# Altium schematic sheet main.SchDoc
size A4
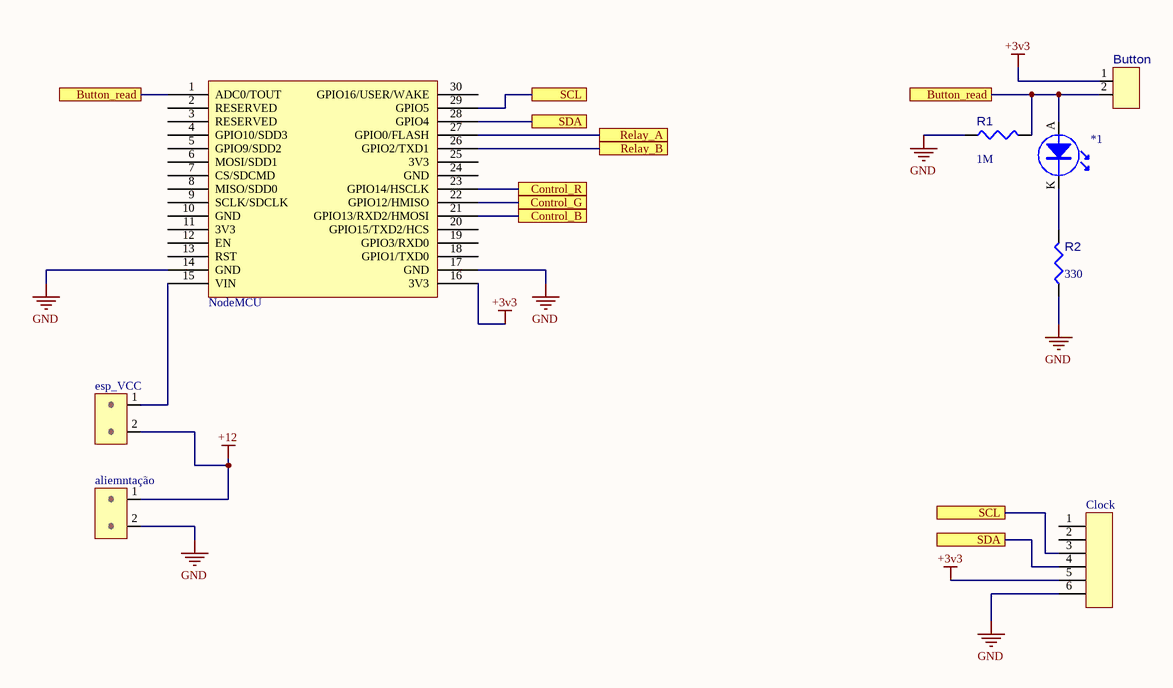
[diagram p0: main.SchDoc]

## Parts
*1  LED_AXIAL_5MM  [HEADER_1X2]  (value not drawn)
aliemntação  ?  [CN_KRE_2]  (value not drawn)
Button  ?  [HEADER_1X2]  (value not drawn)
Clock  HEADER_1X6  [HEADER_1X6]  (value not drawn)
esp_VCC  ?  [HEADER_1X2]  (value not drawn)
NodeMCU  ESP8266 Development kit  [DIV_NodeMCU_Socket]  (value not drawn)
R1  1M  [RES_PTH_7.62MM]
R2  value 330  [RES_PTH_7.62MM]

## Ports
Button_read, Control_B, Control_G, Control_R, Relay_A, Relay_B, SCL, SDA

## Nets
+3v3: Button.1 Clock.5 NodeMCU.16(3V3)
+12: aliemntação.1 esp_VCC.2
GND: aliemntação.2 Clock.6 NodeMCU.14(GND) NodeMCU.17(GND) R1.1 R2.1
Button_read: *1.A Button.2 NodeMCU.1(ADC0/TOUT) R1.2 ; port Button_read
Control_B: NodeMCU.21(GPIO13/RXD2/HMOSI) ; port Control_B
Control_G: NodeMCU.22(GPIO12/HMISO) ; port Control_G
Control_R: NodeMCU.23(GPIO14/HSCLK) ; port Control_R
Relay_A: NodeMCU.27(GPIO0/FLASH) ; port Relay_A
Relay_B: NodeMCU.26(GPIO2/TXD1) ; port Relay_B
SCL: Clock.3 NodeMCU.29(GPIO5) ; port SCL
SDA: Clock.4 NodeMCU.28(GPIO4) ; port SDA
Net*1_K: *1.K R2.2
Netesp_VCC_1: esp_VCC.1 NodeMCU.15(VIN)

Not connected (* = marked no-connect by the designer): Clock 1 2; NodeMCU 2(RESERVED) 3(RESERVED) 4(GPIO10/SDD3) 5(GPIO9/SDD2) 6(MOSI/SDD1) 7(CS/SDCMD) 8(MISO/SDD0) 9(SCLK/SDCLK) 10(GND) 11(3V3) 12(EN) 13(RST) 18(GPIO1/TXD0) 19(GPIO3/RXD0) 20(GPIO15/TXD2/HCS) 24(GND) 25(3V3) 30(GPIO16/USER/WAKE)

## Library data of the parts
*1 = LED_AXIAL_5MM: pin to pad: A>1 K>2; Value: ?
aliemntação esp_VCC = CN_MKDS_2: MKDS_2; Value: ?
Button = HEADER_1X2: 1X2; Value: ?
Clock = HEADER_1X6: 1X6; Value: ?
NodeMCU = NodeMCU: Reference: https://bennthomsen.files.wordpress.com/2015/12/nodemcu_pinout_700-2.png; Schematic: https://raw.githubusercontent.com/nodemcu/nodemcu-devkit/master/Documents/NODEMCU_DEVKIT_SCH.png
R1 R2 = RES_PTH_7.62MM: Pin Through Hole Resistor 7.62mm
  R1: Value: 1M